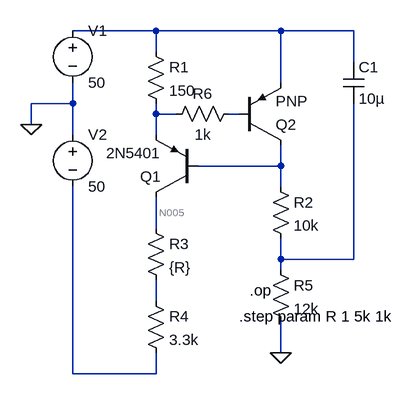
[diagram p0: schematic 2tranz.asc]
2tranz.asc, the LTspice schematic file:
Version 4
SHEET 1 880 680
WIRE 32 16 -96 16
WIRE 224 16 32 16
WIRE 336 16 224 16
WIRE 32 48 32 16
WIRE 336 64 336 16
WIRE 224 96 224 16
WIRE -96 128 -96 96
WIRE -96 128 -160 128
WIRE 32 144 32 128
WIRE 64 144 32 144
WIRE 160 144 144 144
WIRE -160 160 -160 128
WIRE -96 176 -96 128
WIRE 32 176 32 144
WIRE 224 224 224 192
WIRE 224 224 96 224
WIRE 224 256 224 224
WIRE 32 320 32 272
WIRE 224 368 224 336
WIRE 336 368 336 128
WIRE 336 368 224 368
WIRE 224 384 224 368
WIRE 32 432 32 400
WIRE 224 512 224 464
WIRE -96 544 -96 256
WIRE 32 544 32 512
WIRE 32 544 -96 544
FLAG -160 160 0
FLAG 224 512 0
SYMBOL res 16 32 R0
SYMATTR InstName R1
SYMATTR Value 150
SYMBOL res 208 240 R0
SYMATTR InstName R2
SYMATTR Value 10k
SYMBOL cap 320 64 R0
SYMATTR InstName C1
SYMATTR Value 10µ
SYMBOL voltage -96 0 R0
WINDOW 123 0 0 Left 0
WINDOW 39 0 0 Left 0
SYMATTR InstName V1
SYMATTR Value 50
SYMBOL voltage -96 160 R0
WINDOW 123 0 0 Left 0
WINDOW 39 0 0 Left 0
SYMATTR InstName V2
SYMATTR Value 50
SYMBOL pnp 96 272 R180
SYMATTR InstName Q1
SYMATTR Value 2N5401
SYMBOL res 16 304 R0
SYMATTR InstName R3
SYMATTR Value {R}
SYMBOL res 16 416 R0
SYMATTR InstName R4
SYMATTR Value 3.3k
SYMBOL res 208 368 R0
SYMATTR InstName R5
SYMATTR Value 12k
SYMBOL pnp 160 192 M180
SYMATTR InstName Q2
SYMBOL res 160 128 R90
WINDOW 0 0 56 VBottom 2
WINDOW 3 32 56 VTop 2
SYMATTR InstName R6
SYMATTR Value 1k
TEXT 160 456 Left 2 !.step param R 1 5k 1k
TEXT 176 416 Left 2 !.op

The netlist it stands for:
* 2tranz.asc
R1 N001 N002 150
R2 N004 N006 10k
C1 N001 N006 10µ
V1 N001 0 50
V2 0 N008 50
Q1 N005 N004 N002 0 2N5401
R3 N005 N007 {R}
R4 N007 N008 3.3k
R5 N006 0 12k
Q2 N004 N003 N001 0 PNP
R6 N003 N002 1k
.model NPN NPN
.model PNP PNP
.lib standard.bjt
.step param R 1 5k 1k
.op
.backanno
.end

* Results of the author's LTspice run, read from the files saved beside the schematic
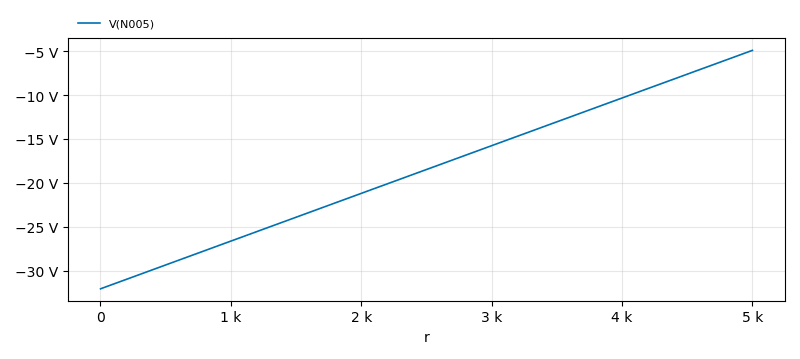
[diagram p1: Operating Point of 2tranz.asc, plotted from the saved traces]
* Operating Point, 1 run:
*   V(N005): -32.05 V at r=1 , -4.916 V at r=5 k, min -32.05 V, max -4.916 V